# EAGLE schematic Opto_v1 (EAGLE 8.6.3)
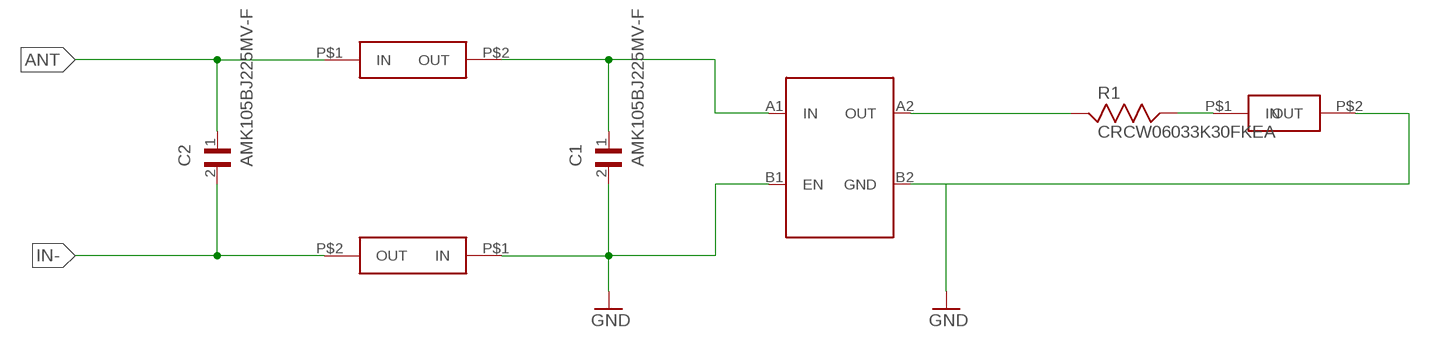
[diagram p0: schematic, sheet 1]

## Parts
C1  AMK105BJ225MV-F  [CAPC1005X55N]
C2  AMK105BJ225MV-F  [CAPC1005X55N]
R1  CRCW06033K30FKEA  [RESC1608X55]
U$1  BGA4C4  [BGA4C40P2X2_84X84X60N]
U$2  SCHOTTKY0402  [0402_MURATA]
U$3  SCHOTTKY0402  [0402_MURATA]
U$4  CREE-TR2227  [CREE-TR2227]

## Nets
ANT: C2.1 U$2.P$1(IN)
GND: C1.2 U$1.B1(EN) U$1.B2(GND) U$3.P$1(IN) U$4.P$2(OUT)
IN-: C2.2 U$3.P$2(OUT)
N$1: R1.1 U$1.A2(OUT)
N$2: R1.2 U$4.P$1(IN)
N$4: C1.1 U$1.A1(IN) U$2.P$2(OUT)

## Library data of the parts
C1 C2 = AMK105BJ225MV-F:AMK105BJ225MV-F: Cap 2.2uF 4VDC X5R 20% SMD 0402 T/R; AVAILABILITY: Unavailable; DESCRIPTION: Cap Ceramic 2.2uF 4V X5R 20% SMD 0402 85°C T/R; MF: Taiyo Yuden; MP: AMK105BJ225MV-F; PACKAGE: 0402 Taiyo Yuden; PRICE: None
R1 = CRCW06033K30FKEA:CRCW06033K30FKEA: Res Thick Film 0603 3.3K Ohm 1% 0.1W(1/10W) ?100ppm/C SMD Automotive Paper T/R; DESCRIPTION: Res Thick Film 0603 3.3K Ohm 1% 0.1W_1/10W_ ?100ppm/C SMD Automotive Paper T/R; DIGI-KEY_PART_NUMBER: 541-3.30KHCT-ND; DIGI-KEY_PURCHASE_URL: https://www.digikey.com/product-detail/en/vishay-dale/CRCW06033K30FKEA/541-3.30KHCT-ND/1179866?utm_source=snapeda&utm_medium=aggregator&utm_campaign=symbol; MF: Vishay Dale; MP: CRCW06033K30FKEA; PACKAGE: 0603 Vishay
U$1 = LOD_BGA4C40P2X2_84X84X60N:BGA4C4
U$2 U$3 = Schottki_0402:SCHOTTKY0402
U$4 = CREE-TR2227:CREE-TR2227